# Altium project Merilnik_hitrosti.PrjPcb
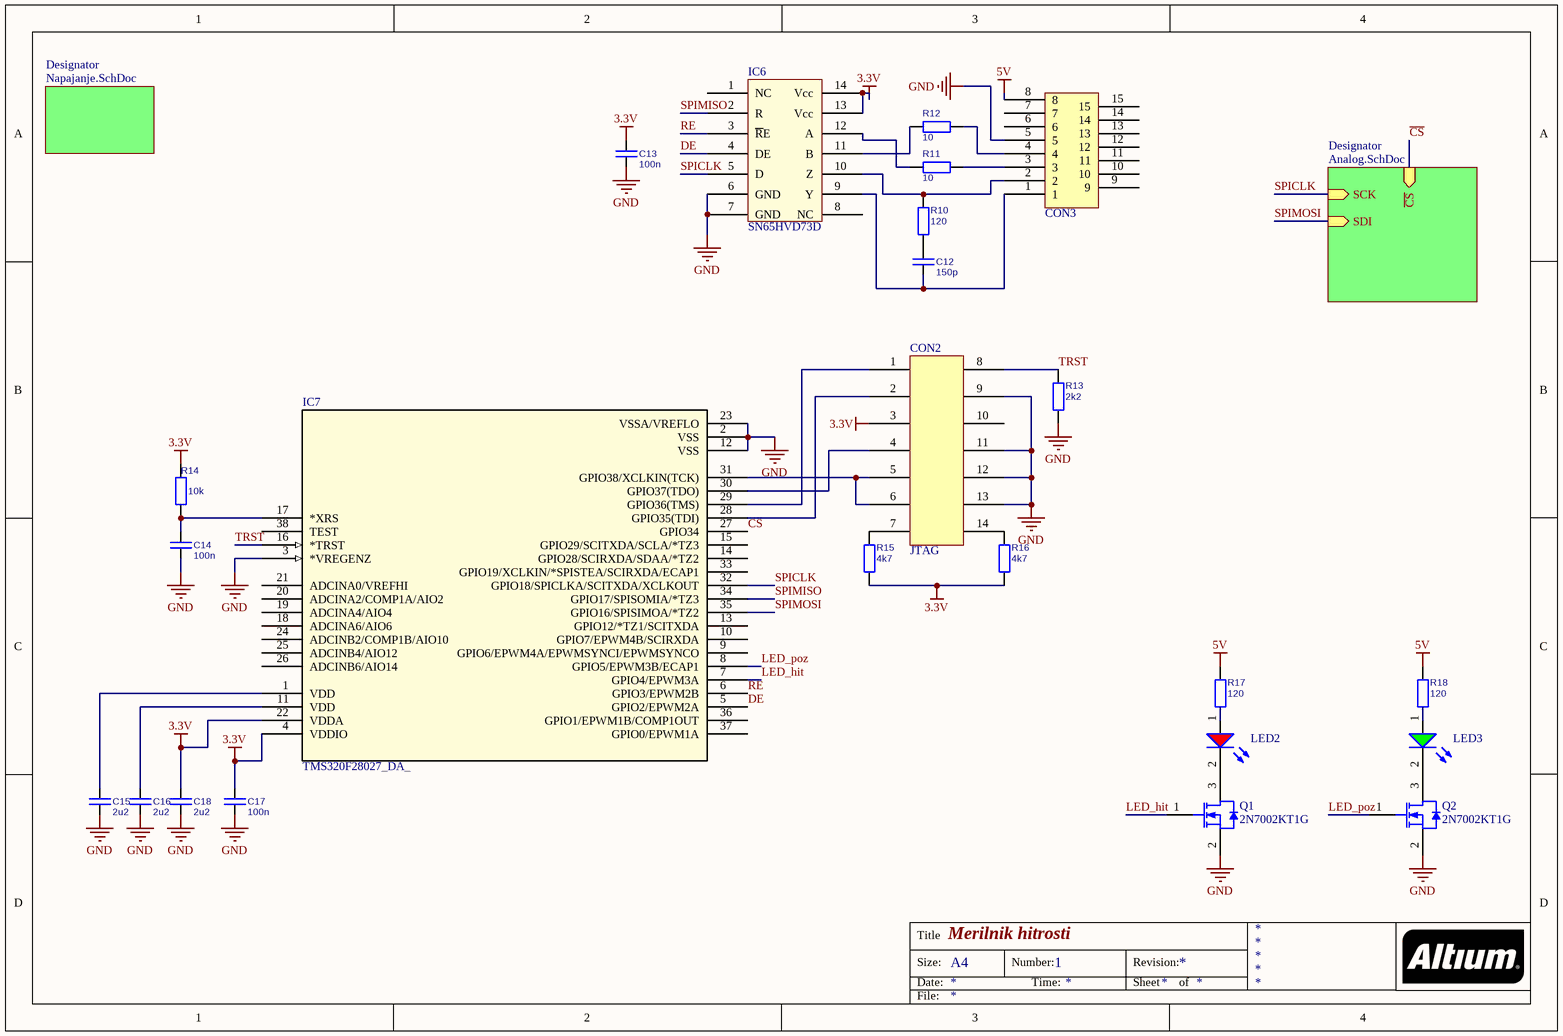
[diagram p0: Sheet1_popravljena.SchDoc]
3 sheets, 56 parts. Net scope: hierarchical (ports join the sheet entries above them; power ports are global).
Board files: Merilnik_2016_12_20.PcbDoc, Merilnik_2017_01_13.PcbDoc
Sheets:
  Sheet1_popravljena.SchDoc
    Designator = Napajanje.SchDoc
    Designator = Analog.SchDoc

## Sheet Sheet1_popravljena.SchDoc: Merilnik hitrosti
size A4; Author: Mitja Alic; DocumentNumber: 1; DocumentName: Microcontroler

### Parts
C12  150p  [C0603]
C13  100n  [C0603]
C14  100n  [C0603]
C15  2u2  [C0603]
C16  2u2  [C0603]
C17  100n  [C0603]
C18  2u2  [C0603]
CON2  JTAG  [JTAG micromatch]
CON3  DSUbConector  [DSUB conector]  (value not drawn)
IC6  SN65HVD73D
IC7  TMS320F28027_DA_  [TSOP65P810X120-38N]
LED2  150060RS75000  [LED_0603_Red]  (value not drawn)
LED3  150060VS75000  [LED_0603_Bright Green]  (value not drawn)
Q1  2N7002KT1G  [NXP-SOT23_N]
Q2  2N7002KT1G  [NXP-SOT23_N]
R10  120  [R0603]
R11  10  [R0603]
R12  10  [R0603]
R13  value 2k2  [R0805]  (hidden comment: 120)
R14  value 10k  [R0805]  (hidden comment: 120)
R15  4k7  [R0805]
R16  4k7  [R0805]
R17  120  [R0805]
R18  120  [R0805]

### Sub-sheets
Designator = Napajanje.SchDoc: no entries
Designator = Analog.SchDoc: SCK (in), SDI (in), ~{CS} (in)

### Nets
3.3V: C13.1 C17.1 C18.1 CON2.3 IC6.13(Vcc) IC6.14(Vcc) IC7.4(VDDIO) IC7.22(VDDA) R14.1 R15.1 R16.1
5V: CON3.8 R17.1 R18.1
GND: C13.2 C14.2 C15.2 C16.2 C17.2 C18.2 CON2.9 CON2.11 CON2.12 CON2.13 CON3.5 IC6.6(GND) IC6.7(GND) IC7.2(VSS) IC7.3(*VREGENZ) IC7.12(VSS) IC7.23(VSSA/VREFLO) Q1.2(S) Q2.2(S) R13.1
~{CS}: IC7.27(GPIO34) ; sheet Designator/~{CS}
DE: IC6.4(DE) IC7.5(GPIO2/EPWM2A)
LED_hit: IC7.7(GPIO4/EPWM3A) Q1.1(G)
LED_poz: IC7.8(GPIO5/EPWM3B/ECAP1) Q2.1(G)
RE: IC6.3(~{R}E) IC7.6(GPIO3/EPWM2B)
SPICLK: IC6.5(D) IC7.32(GPIO18/SPICLKA/SCITXDA/XCLKOUT) ; sheet Designator/SCK
SPIMISO: IC6.2(R) IC7.34(GPIO17/SPISOMIA/*TZ3)
SPIMOSI: IC7.35(GPIO16/SPISIMOA/*TZ2) ; sheet Designator/SDI
TRST: CON2.8 IC7.16(*TRST) R13.2
NetC12_1: C12.1 R10.2
NetC12_2: C12.2 CON3.1 IC6.9(Y)
NetC14_1: C14.1 IC7.17(*XRS) R14.2
NetC15_1: C15.1 IC7.1(VDD)
NetC16_1: C16.1 IC7.11(VDD)
NetCON2_1: CON2.1 IC7.29(GPIO36(TMS))
NetCON2_2: CON2.2 IC7.28(GPIO35(TDI))
NetCON2_4: CON2.4 IC7.30(GPIO37(TDO))
NetCON2_5: CON2.5 CON2.6 IC7.31(GPIO38/XCLKIN(TCK))
NetCON2_7: CON2.7 R15.2
NetCON2_14: CON2.14 R16.2
NetCON3_2: CON3.2 IC6.10(Z) R10.1
NetCON3_3: CON3.3 R11.1
NetCON3_4: CON3.4 R12.1
NetIC6_11: IC6.11(B) R12.2
NetIC6_12: IC6.12(A) R11.2
NetLED2_1: LED2.1(A) R17.2
NetLED2_2: LED2.2(C) Q1.3(D)
NetLED3_1: LED3.1(A) R18.2
NetLED3_2: LED3.2(C) Q2.3(D)

Not connected (* = marked no-connect by the designer): CON2 10; CON3 6 7 9 10 11 12 13 14 15; IC6 1(NC) 8(NC); IC7 9(GPIO6/EPWM4A/EPWMSYNCI/EPWMSYNCO) 10(GPIO7/EPWM4B/SCIRXDA) 13(GPIO12/*TZ1/SCITXDA) 14(GPIO28/SCIRXDA/SDAA/*TZ2) 15(GPIO29/SCITXDA/SCLA/*TZ3) 18(ADCINA6/AIO6) 19(ADCINA4/AIO4) 20(ADCINA2/COMP1A/AIO2) 21(ADCINA0/VREFHI) 24(ADCINB2/COMP1B/AIO10) 25(ADCINB4/AIO12) 26(ADCINB6/AIO14) 33(GPIO19/XCLKIN/*SPISTEA/SCIRXDA/ECAP1) 36(GPIO1/EPWM1B/COMP1OUT) 37(GPIO0/EPWM1A) 38(TEST)

### Notes on the sheet
- Title
- Size:
- Date:
- A4
- Number:
- Time:
- Revision:
- Sheet
- of
- File:

### Library data of the parts
C12-C18 = C: Capacitor
  C12: Value: 150p
  C13 C14 C17: Value: 100n
  C15 C16 C18: Value: 2u2
IC7 = TMS320F28027_DA_: Imported; Manufacturer_Part_Number: tms320f28027_da_38; Vendor: Texas Instruments; RefDes: RefDes; Type: DEV; Value: Value; Supplier 1: Farnell; Supplier Part Number 1: 2076786
LED2 = WL-SMCW 0603  150060RS75000: SMD mono-color Chip LED, WL-SMCW, Red; Manufacturer: W黵th Elektronik eiSos GmbH; PartNo: 150060RS75000; ComponentLink1Description: Manufacturer; ComponentLink1URL: http://www.we-online.de; Created by: Christin Otto; Created Date: June 2013; ComponentLink2Description: Datasheet; ComponentLink2URL: http://katalog.we-online.com/led/datasheet/150060RS75000.pdf; Color: Red; Supplier 1: Farnell; Supplier Part Number 1: 2322071
LED3 = WL-SMCW 0603  150060VS75000: SMD mono-color Chip LED, WL-SMCW, Bright Green; Manufacturer: W黵th Elektronik eiSos GmbH; PartNo: 150060VS75000; ComponentLink1Description: Manufacturer; ComponentLink1URL: http://www.we-online.de; Created by: Christin Otto; Created Date: June 2013; ComponentLink2Description: Datasheet; ComponentLink2URL: http://katalog.we-online.com/led/datasheet/150060VS75000.pdf; Color: Bright Green; Supplier 1: Farnell; Supplier Part Number 1: 2322073
Q1 Q2 = BSN20,215: N-Channel Enhancement Mode Field-Effect Transistor, 50 V, 0.173 A, 3-Pin SOT23, Tape and Reel; Supplier 1: Farnell; Supplier Part Number 1: 1764535
R10-R18 = R
  R10: Value: 120
  R11 R12: Value: 10
  R14: Supplier 1: Farnell; Supplier Part Number 1: 9332596
  R15 R16: Value: 4k7
  R17 R18: Value: 120; Supplier 1: Farnell; Supplier Part Number 1: 9332596
CON2 = JTAG: Supplier Part Number 1: 148647; Supplier 1: Farnell
CON3 = DSUbConector: Supplier 1: Farnell; Supplier Part Number 1: 1099295
IC6 = SN65HVD73D: Supplier 1: Farnell; Supplier Part Number 1: 2455484

## Sheet Napajanje.SchDoc
size A4
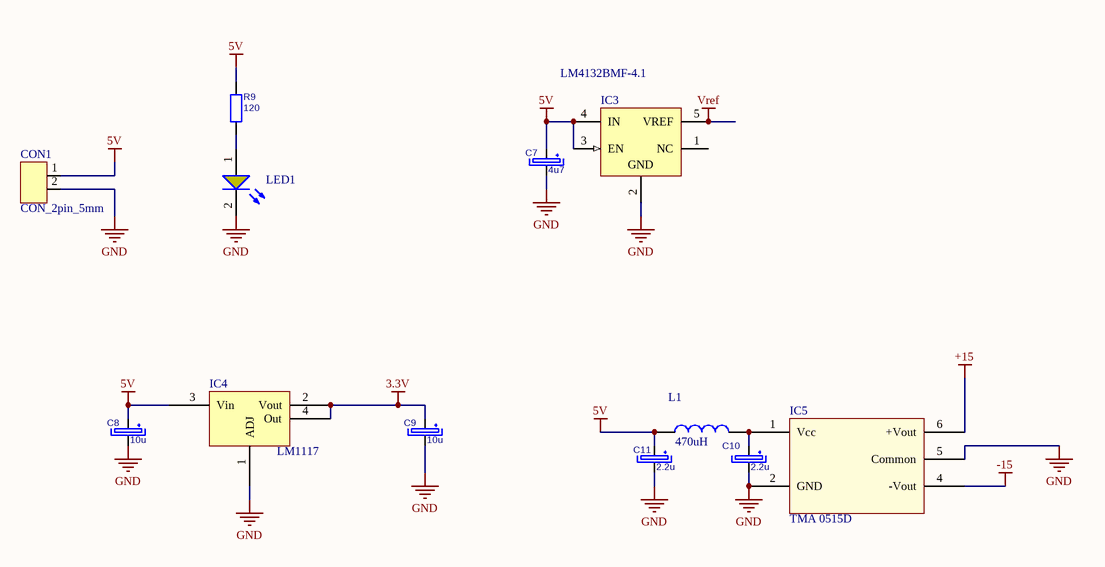
[diagram p1: Napajanje.SchDoc]

### Parts
C7  4u7  [C Tantal A]
C8  10u  [C Tantal B]
C9  10u  [C Tantal B]
C10  2.2u  [C Tantal B]
C11  2.2u  [C Tantal B]
CON1  CON_2pin_5mm  [CON_2pin_5mm]
IC3  LM4132BMF-4.1  [SOT95P280X145-5N]
IC4  LM1117  [SOT230P700X180-4N]
IC5  TMA 0515D  [TMA 0515D]
L1  value 470uH  [WE-PD2_7850]  (hidden comment: WE-PD2, 74477530)
LED1  150060YS75000  [LED_0603_Yellow]  (value not drawn)
R9  120  [R0805]

### Nets
3.3V: C9.1 IC4.2(Vout) IC4.4(Out)
5V: C7.1 C8.1 C11.1 CON1.1 IC3.3(EN) IC3.4(IN) IC4.3(Vin) L1.1 R9.1
+15: IC5.6(+Vout)
-15: IC5.4(-Vout)
GND: C7.2 C8.2 C9.2 C10.2 C11.2 CON1.2 IC3.2(GND) IC4.1(ADJ) IC5.2(GND) IC5.5(Common) LED1.2(C)
Vref: IC3.5(VREF)
NetC10_1: C10.1 IC5.1(Vcc) L1.2
NetLED1_1: LED1.1(A) R9.2

Not connected (* = marked no-connect by the designer): IC3 1(NC)

### Notes on the sheet
- Title
- Size:
- Date:
- A4
- Number:
- Time:
- Revision:
- Sheet
- of
- File:

### Library data of the parts
C7-C11 = C+: Capacitor Polarized
  C7: Value: 4u7
  C8 C9: Value: 10u
  C10 C11: Value: 2.2u
CON1 = CON_2pin_5mm: Konektor za  Bernic ohišja Serija 605, 5 mm raster; Supplier 1: Farnell; Supplier Part Number 1: 1792766
IC3 = LM4132BMF-4.1: Precision Low Dropout Voltage Reference, 5-pin SOT-23; Manufacturer: National Semiconductor; PackageTopMarking: R4FB*XTT; PowerWise: Y; CompType: Voltage Reference IC; DatasheetVersion: Aug-2006; PackageVersion: revD, Aug-2008; PackageReference: MF05A; PackageDescription: Molded SOT-23, .115 x .063 x .040 in Body, 5 Lead, .0375 in Pitch; PartNumber: LM4132BMF-4.1; RoHS: N; PinCount: 5; ComponentLink1Description: Manufacturer URL; ComponentLink1URL: http://www.national.com/; ComponentLink2Description: LM4132 Datasheet; ComponentLink2URL: http://www.national.com/ds/LM/LM4132.pdf; ComponentLink3Description: LM4132 Web Page; ComponentLink3URL: http://www.national.com/pf/LM/LM4132.html; ComponentLink4Description: MF05A Package Page; ComponentLink4URL: http://www.national.com/packaging/folders/mf05a.html; Supplier 1: Farnell; Supplier Part Number 1: 1559272
L1 = WE-PD2, 74477530: WE-PD2 SMD Power Inductor, size 7850, 1000uH; Size: 7850; Supplier 1: Farnell; Supplier Part Number 1: 2062739
LED1 = WL-SMCW 0603  150060YS75000: SMD mono-color Chip LED, WL-SMCW, Yellow; Manufacturer: W黵th Elektronik eiSos GmbH; PartNo: 150060YS75000; ComponentLink1Description: Manufacturer; ComponentLink1URL: http://www.we-online.de; Created by: Christin Otto; Created Date: June 2013; ComponentLink2Description: Datasheet; ComponentLink2URL: http://katalog.we-online.com/led/datasheet/150060YS75000.pdf; Color: Yellow; Supplier 1: Farnell; Supplier Part Number 1: 2322074
R9 = R: Value: 120; Supplier 1: Farnell; Supplier Part Number 1: 9332596
IC4 = LM1117: Supplier 1: Farnell; Supplier Part Number 1: 1469051
IC5 = TMA 0515D: Supplier 1: Farnell; Supplier Part Number 1: 1007516

## Sheet Analog.SchDoc
size A4
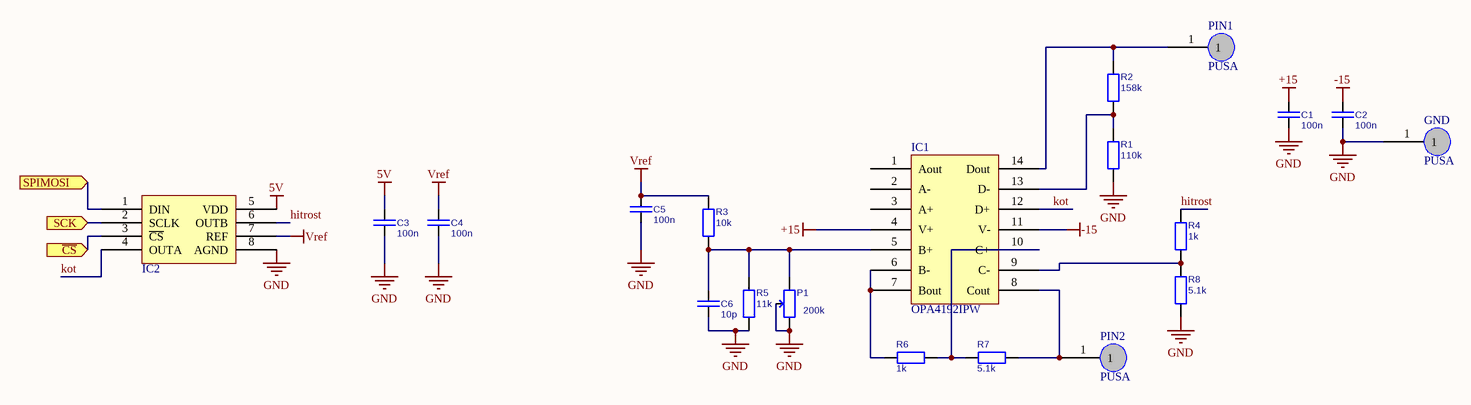
[diagram p2: Analog.SchDoc]

### Parts
C1  100n  [C0603]
C2  100n  [C0603]
C3  100n  [C0603]
C4  100n  [C0603]
C5  100n  [C0603]
C6  10p  [C0603]
GND  PUSA  [PUSA]
IC1  OPA4192IPW  [OPA4192]
IC2  TLV5618ACD  [TLV5618ACD]  (value not drawn)
P1  200k  [Bourns_3266W]
PIN1  PUSA  [PUSA]
PIN2  PUSA  [PUSA]
R1  110k  [R0603]
R2  158k  [R0603]
R3  10k  [R0603]
R4  1k  [R0603]
R5  11k  [R0603]
R6  1k  [R0603]
R7  5.1k  [R0603]
R8  5.1k  [R0603]

### Ports
SCK (in), SPIMOSI (in), ~{CS} (in)

### Nets
5V: C3.1 IC2.5(VDD)
+15: C1.1 IC1.4(V+)
-15: C2.1 IC1.11(V-)
GND: C1.2 C2.2 C3.2 C4.2 C5.2 C6.2 GND.1 IC2.8(AGND) P1.2 P1.3 R1.2 R5.2 R8.2
Vref: C4.1 C5.1 IC2.7(REF) R3.1
~{CS}: IC2.3(~{CS}) ; port ~{CS}
hitrost: IC2.6(OUTB) R4.2
kot: IC1.12(D+) IC2.4(OUTA)
SPICLK: IC2.2(SCLK) ; port SCK
NetC6_1: C6.1 IC1.5(B+) P1.1 R3.2 R5.1
NetIC1_6: IC1.6(B-) IC1.7(Bout) R6.2
NetIC1_8: IC1.8(Cout) PIN2.1 R7.1
NetIC1_9: IC1.9(C-) R4.1 R8.1
NetIC1_10: IC1.10(C+) R6.1 R7.2
NetIC1_13: IC1.13(D-) R1.1 R2.2
NetIC1_14: IC1.14(Dout) PIN1.1 R2.1
NetIC2_1: IC2.1(DIN) ; port SPIMOSI

Not connected (* = marked no-connect by the designer): IC1 1(Aout) 2(A-) 3(A+)

### Notes on the sheet
- Title
- Size:
- Date:
- A4
- Number:
- Time:
- Revision:
- Sheet
- of
- File:

### Library data of the parts
C1-C6 = C: Capacitor
  C1-C5: Value: 100n
  C6: Value: 10p
IC1 = OPA4192IPW onepack: Supplier 1: Farnell; Supplier Part Number 1: 2526481
P1 = POT: POTENTIOMETER; Value: 200k; Supplier Part Number 1: 9352651; Supplier 1: Farnell
R1-R8 = R
  R1: Value: 110k
  R2: Value: 158k
  R3: Value: 10k
  R4 R6: Value: 1k
  R5: Value: 11k
  R7 R8: Value: 5.1k
IC2 = TLV5618ACD: Supplier 1: Farnell; Supplier Part Number 1: 2342319

## Nets that join several sheets
3.3V: Sheet1_popravljena (11 pins), Napajanje (C9.1 IC4.2 IC4.4)
5V: Sheet1_popravljena (CON3.8 R17.1 R18.1), Napajanje (9 pins), Analog (C3.1 IC2.5)
+15: Napajanje (IC5.6), Analog (C1.1 IC1.4)
-15: Napajanje (IC5.4), Analog (C2.1 IC1.11)
GND: Sheet1_popravljena (20 pins), Napajanje (11 pins), Analog (13 pins)
Vref: Napajanje (IC3.5), Analog (C4.1 C5.1 IC2.7 R3.1)
~{CS}: Sheet1_popravljena (IC7.27), Analog (IC2.3)
SPICLK: Sheet1_popravljena (IC6.5 IC7.32), Analog (IC2.2)